# Altium schematic sheet [26] - BLE, WIFI.SchDoc (part 1 of 2)
size A2; DocumentNumber: 25; SheetNumber: 25; SheetTotal: 32
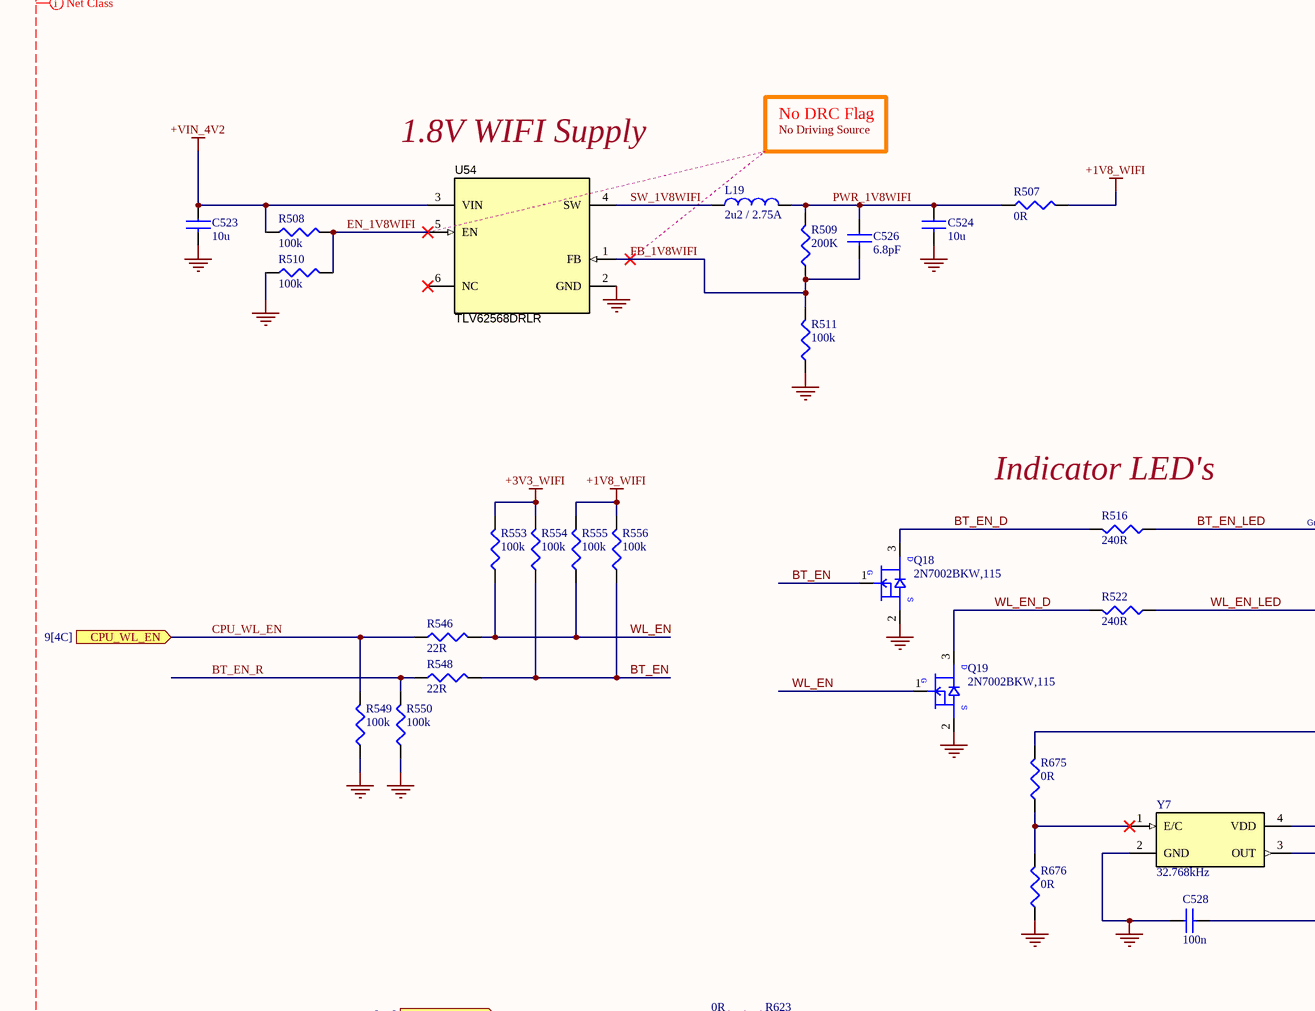
[diagram p0: [26] - BLE, WIFI.SchDoc, top left]
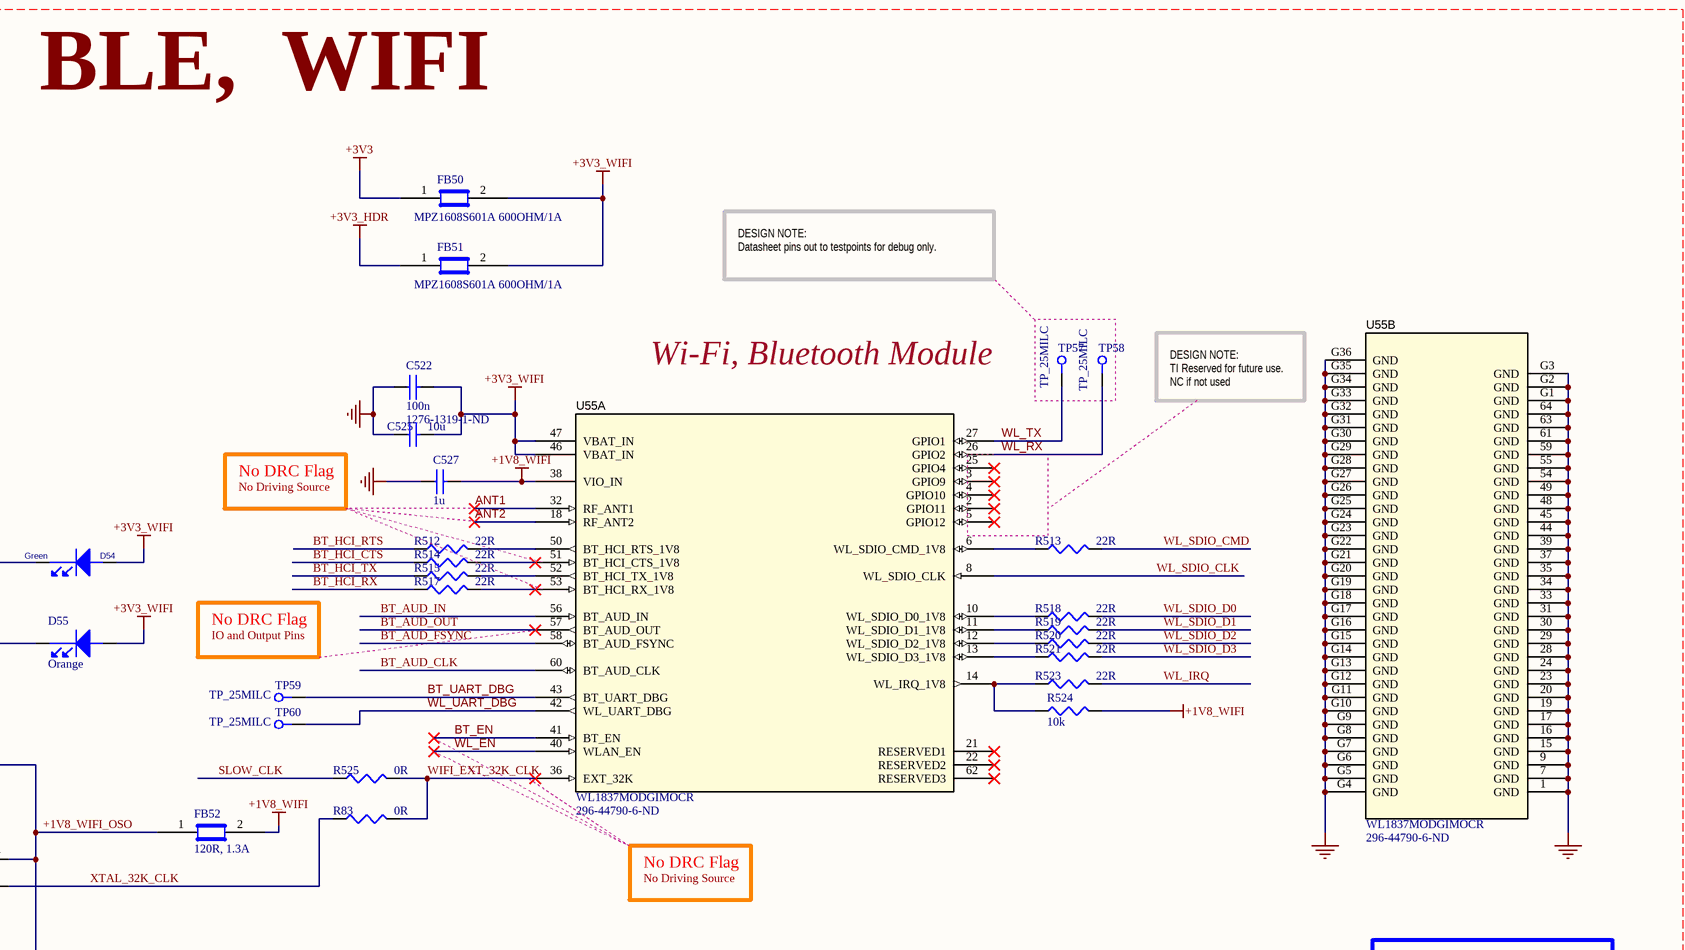
[diagram p1: [26] - BLE, WIFI.SchDoc, top right]
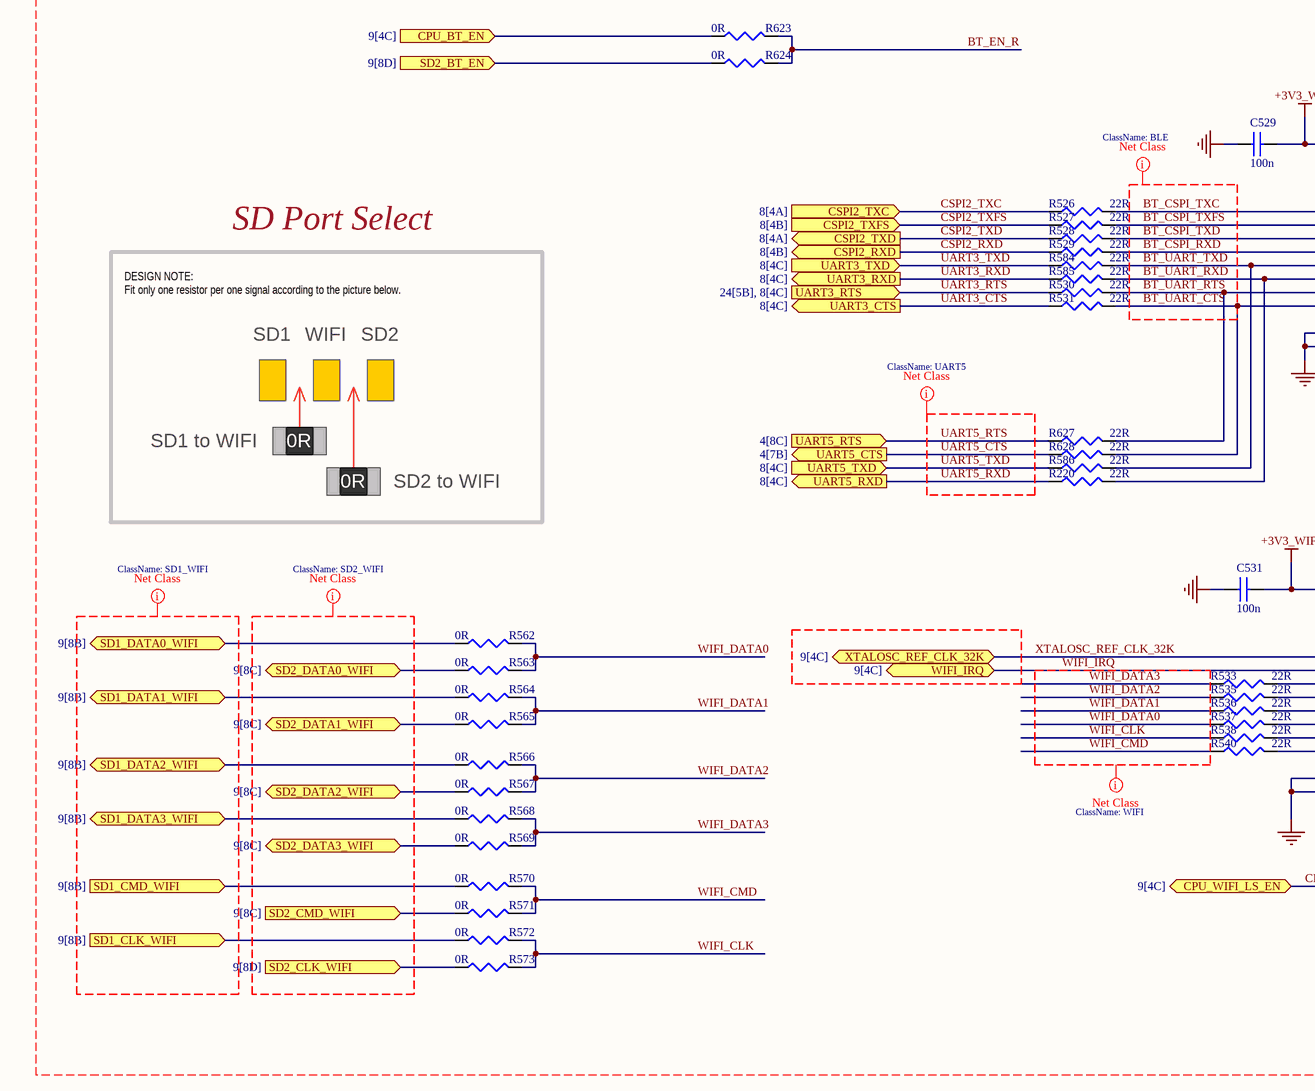
[diagram p2: [26] - BLE, WIFI.SchDoc, bottom left]
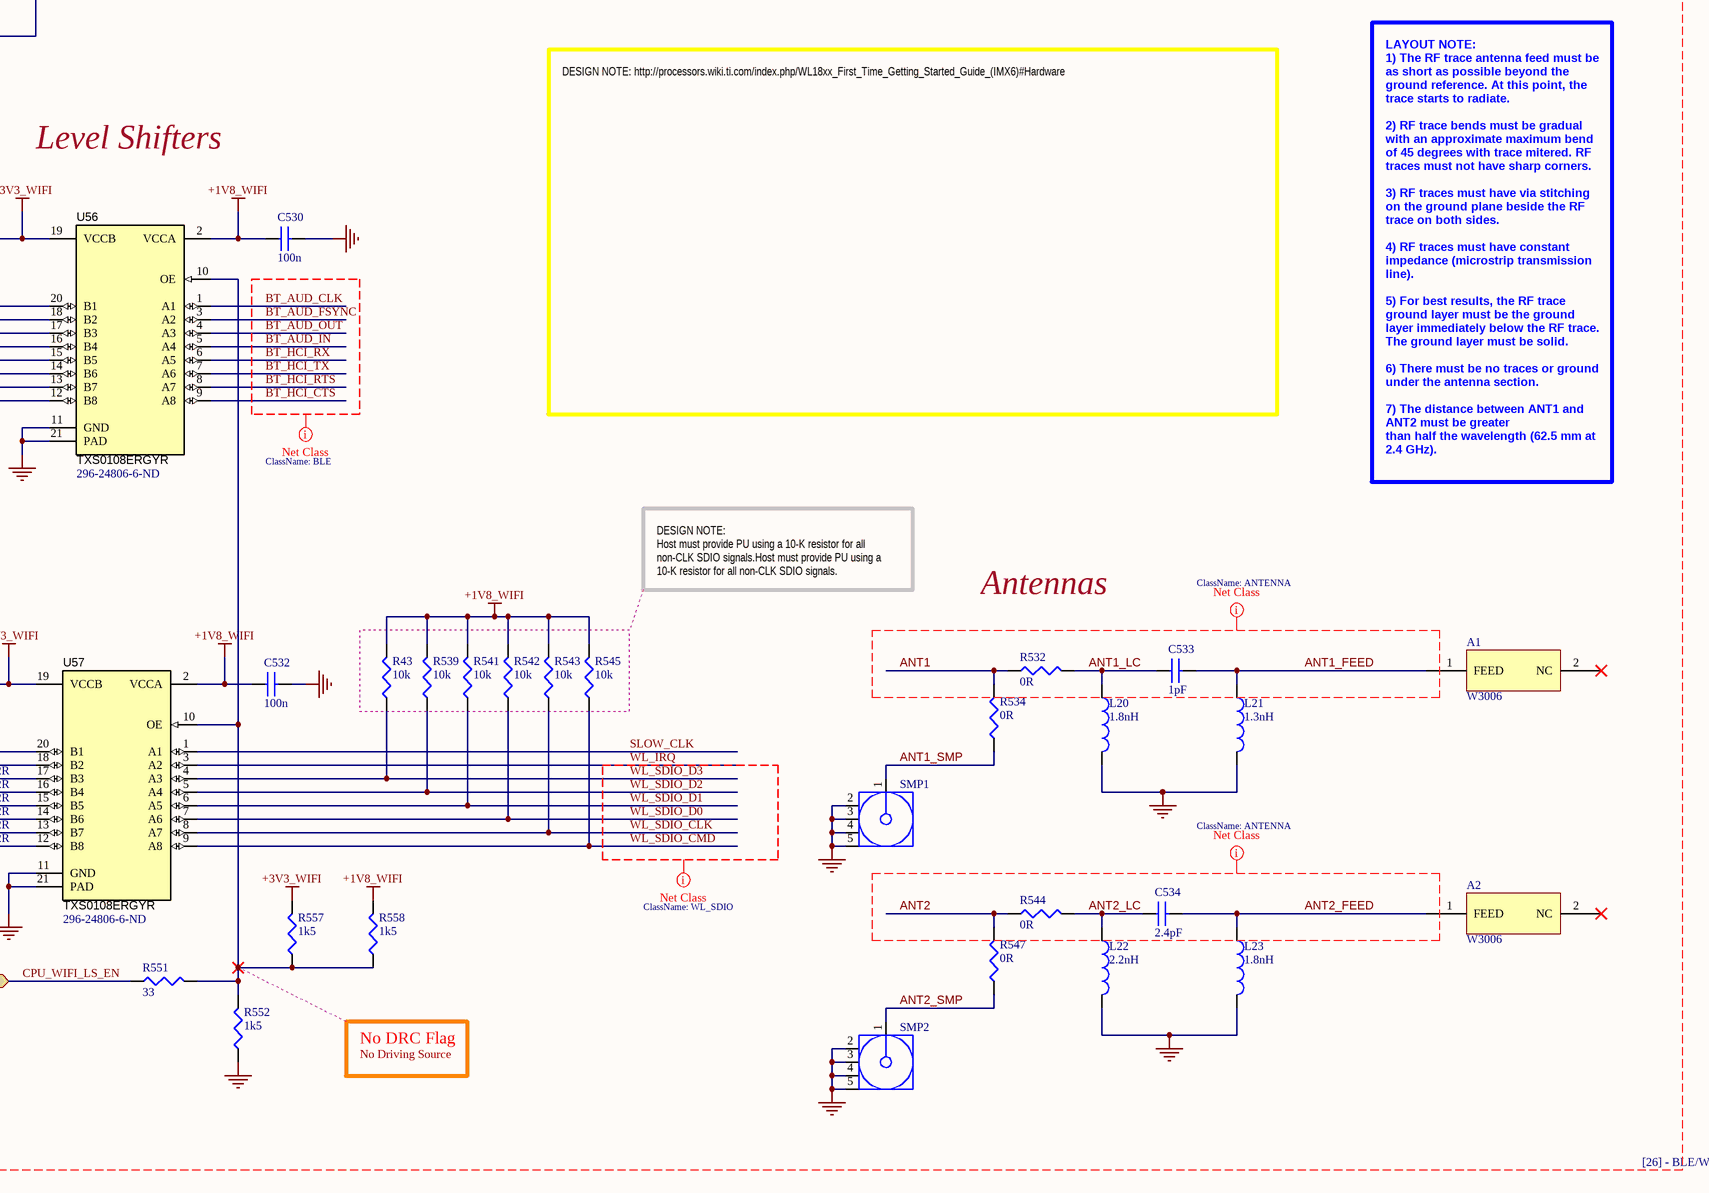
[diagram p3: [26] - BLE, WIFI.SchDoc, bottom right]

## Parts
A1  W3006  [W3006]
A2  W3006  [W3006]
C522  100n  Supplier Part Number 2: 1276-1319-1-ND  [C0201]
C523  10u  [C0603]
C524  10u  [C0603]
C525  10u  [C0603]
C526  6.8pF  [C0201]
C527  1u  [C0402]
C528  100n  [C0402]
C529  100n  [C0402]
C530  100n  [C0402]
C531  100n  [C0402]
C532  100n  [C0402]
C533  1pF  [C0402]
C534  2.4pF  [c0402]
D54  Green  [LED_0603]
D55  Orange  [LED_0603]
FB50  MPZ1608S601A 600OHM/1A  [C0603]
FB51  MPZ1608S601A 600OHM/1A  [C0603]
FB52  120R, 1.3A  [C0402]
L19  2u2 / 2.75A  [IHLP_160MILX175MIL]
L20  1.8nH  [LQP_0402]
L21  1.3nH  [LQP_0402]
L22  2.2nH  [LQP_0402]
L23  1.8nH  [LQP_0402]
Q18  2N7002BKW,115  [SC70_SOT323]
Q19  2N7002BKW,115  [SC70_SOT323]
R43  10k  [R0201]
R83  0R  [R0402]
R220  22R  [R0402]
R507  0R  [R0805_small]
R508  100k  [R0402]
R509  200K  [R0402]
R510  100k  [R0402]
R511  100k  [R0402]
R512  22R  [R0402]
R513  22R  [R0402]
R514  22R  [R0402]
R515  22R  [R0402]
R516  240R  [R0402]
R517  22R  [R0402]
R518  22R  [R0402]
R519  22R  [R0402]
R520  22R  [R0402]
R521  22R  [R0402]
R522  240R  [R0402]
R523  22R  [R0402]
R524  10k  [R0402]
R525  0R  [R0402]
R526  22R  [R0402]
R527  22R  [R0402]
R528  22R  [R0402]
R529  22R  [R0402]
R530  22R  [R0402]
R531  22R  [R0402]
R532  0R  [R0402]
R533  22R  [R0402]
R534  0R  [R0402]
R535  22R  [R0402]
R536  22R  [R0402]
R537  22R  [R0402]
R538  22R  [R0402]
R539  10k  [R0201]
R540  22R  [R0402]
R541  10k  [R0201]
R542  10k  [R0201]
R543  10k  [R0201]
R544  0R  [R0402]
R545  10k  [R0201]
R546  22R  [R0402]
R547  0R  [R0402]
R548  22R  [R0402]
R549  100k  [R0402]
R550  100k  [R0402]
R551  33  [R0201]
R552  1k5  [R0402]
R553  100k  [R0402]
R554  100k  [R0402]
R555  100k  [R0402]
R556  100k  [R0402]
R557  1k5  [R0402]
R558  1k5  [R0402]
R562  0R  [R0402]
R563  0R  [R0402]
R564  0R  [R0402]
R565  0R  [R0402]
R566  0R  [R0402]
R567  0R  [R0402]
R568  0R  [R0402]
R569  0R  [R0402]
R570  0R  [R0402]
R571  0R  [R0402]
R572  0R  [R0402]
R573  0R  [R0402]
R584  22R  [R0402]
R585  22R  [R0402]
R586  22R  [R0402]
R623  0R  [R0402]
R624  0R  [R0402]
R627  22R  [R0402]
R628  22R  [R0402]
R675  0R  [R0402]
R676  0R  [R0402]
SMP1  Coax Conn  [SMP-F]  (value not drawn)
SMP2  Coax Conn  [SMP-F]  (value not drawn)
TP57  TP_25MILC  [TP_25C]  (no BOM)
TP58  TP_25MILC  [TP_25C]  (no BOM)
TP59  TP_25MILC  [TP_25C]  (no BOM)
TP60  TP_25MILC  [TP_25C]  (no BOM)
U54  TLV62568DRLR  [DRL0006A]
U55  WL1837MODGIMOCR  Supplier Part Number 1: 296-44790-6-ND  [MOC0100A]  (parts A,B of 2)
U56  TXS0108ERGYR  Supplier Part Number 1: 296-24806-6-ND  [RGY0020A]
U57  TXS0108ERGYR  Supplier Part Number 1: 296-24806-6-ND  [RGY0020A]
Y7  32.768kHz  [ASDK2-32.768KHZ-LR-T3]

## Ports
CPU_BT_EN (in, see 9[4C]), CPU_WIFI_LS_EN (bidir, see 9[4C]), CPU_WL_EN (in, see 9[4C]), CSPI2_RXD (out, see 8[4B]), CSPI2_TXC (in, see 8[4A]), CSPI2_TXD (out, see 8[4A]), CSPI2_TXFS (in, see 8[4B]), SD1_CLK_WIFI (in, see 9[8B]), SD1_CMD_WIFI (in, see 9[8B]), SD1_DATA0_WIFI (bidir, see 9[8B]), SD1_DATA1_WIFI (bidir, see 9[8B]), SD1_DATA2_WIFI (bidir, see 9[8B]), SD1_DATA3_WIFI (bidir, see 9[8B]), SD2_BT_EN (in, see 9[8D]), SD2_CLK_WIFI (in, see 9[8D]), SD2_CMD_WIFI (in, see 9[8C]), SD2_DATA0_WIFI (bidir, see 9[8C]), SD2_DATA1_WIFI (bidir, see 9[8C]), SD2_DATA2_WIFI (bidir, see 9[8C]), SD2_DATA3_WIFI (bidir, see 9[8C]), UART3_CTS (out, see 8[4C]), UART3_RTS (in, see 24[5B], 8[4C]), UART3_RXD (out, see 8[4C]), UART3_TXD (in, see 8[4C]), UART5_CTS (out, see 4[7B]), UART5_RTS (in, see 4[8C]), UART5_RXD (out, see 8[4C]), UART5_TXD (in, see 8[4C]), WIFI_IRQ (bidir, see 9[4C]), XTALOSC_REF_CLK_32K (bidir, see 9[4C])

## Nets
+1V8_WIFI: C527.2 C530.1 C532.1 FB52.2 R43.2 R507.2 R524.2 R539.2 R541.2 R542.2 R543.2 R545.2 R555.2 R556.2 R558.2 U55.38(VIO_IN) U56.2(VCCA) U57.2(VCCA)
+3V3: FB50.1
+3V3_HDR: FB51.1
+3V3_WIFI: C522.2 C525.2 C529.2 C531.2 D54.2(ANODE) D55.2(ANODE) FB50.2 FB51.2 R553.2 R554.2 R557.2 U55.46(VBAT_IN) U55.47(VBAT_IN) U56.19(VCCB) U57.19(VCCB)
+VIN_4V2: C523.1 R508.1 U54.3(VIN)
GND: C522.1 C523.2 C524.2 C525.1 C527.1 C528.1 C529.1 C530.2 C531.1 C532.2 L20.2 L21.2 L22.2 L23.2 Q18.2(SOURCE) Q19.2(SOURCE) R510.1 R511.1 R549.1 R550.1 R552.1 R676.1 SMP1.2(GND) SMP1.3(GND) SMP1.4(GND) SMP1.5(GND) SMP2.2(GND) SMP2.3(GND) SMP2.4(GND) SMP2.5(GND) U54.2(GND) U55.1(GND) U55.7(GND) U55.9(GND) U55.15(GND) U55.16(GND) U55.17(GND) U55.19(GND) U55.20(GND) U55.23(GND) U55.24(GND) U55.28(GND) U55.29(GND) U55.30(GND) U55.31(GND) U55.33(GND) U55.34(GND) U55.35(GND) U55.37(GND) U55.39(GND) U55.44(GND) U55.45(GND) U55.48(GND) U55.49(GND) U55.54(GND) U55.55(GND) U55.59(GND) U55.61(GND) U55.63(GND) U55.64(GND) U55.G1(GND) U55.G2(GND) U55.G3(GND) U55.G4(GND) U55.G5(GND) U55.G6(GND) U55.G7(GND) U55.G8(GND) U55.G9(GND) U55.G10(GND) U55.G11(GND) U55.G12(GND) U55.G13(GND) U55.G14(GND) U55.G15(GND) U55.G16(GND) U55.G17(GND) U55.G18(GND) U55.G19(GND) U55.G20(GND) U55.G21(GND) U55.G22(GND) U55.G23(GND) U55.G24(GND) U55.G25(GND) U55.G26(GND) U55.G27(GND) U55.G28(GND) U55.G29(GND) U55.G30(GND) U55.G31(GND) U55.G32(GND) U55.G33(GND) U55.G34(GND) U55.G35(GND) U55.G36(GND) U56.11(GND) U56.21(PAD) U57.11(GND) U57.21(PAD) Y7.2(GND)
+1V8_WIFI_OSO: C528.2 FB52.1 R675.2 Y7.4(VDD)
ANT1: R532.1 R534.2 U55.32(RF_ANT1)
ANT1_FEED: A1.1(FEED) C533.2 L21.1
ANT1_LC: C533.1 L20.1 R532.2
ANT1_SMP: R534.1 SMP1.1(Signal)
ANT2: R544.1 R547.2 U55.18(RF_ANT2)
ANT2_FEED: A2.1(FEED) C534.2 L23.1
ANT2_LC: C534.1 L22.1 R544.2
ANT2_SMP: R547.1 SMP2.1(Signal)
BT_AUD_CLK: U55.60(BT_AUD_CLK) U56.1(A1)
BT_AUD_FSYNC: U55.58(BT_AUD_FSYNC) U56.3(A2)
BT_AUD_IN: U55.56(BT_AUD_IN) U56.5(A4)
BT_AUD_OUT: U55.57(BT_AUD_OUT) U56.4(A3)
BT_CSPI_RXD: R529.2 U56.16(B4)
BT_CSPI_TXC: R526.2 U56.20(B1)
BT_CSPI_TXD: R528.2 U56.17(B3)
BT_CSPI_TXFS: R527.2 U56.18(B2)
BT_EN: Q18.1(GATE) R548.2 R554.1 R556.1 U55.41(BT_EN)
BT_EN_D: Q18.3(DRAIN) R516.2
BT_EN_LED: D54.1(cathode) R516.1
BT_EN_R: R548.1 R550.2 R623.2 R624.2
BT_HCI_CTS: R514.1 U56.9(A8)
BT_HCI_RTS: R512.1 U56.8(A7)
BT_HCI_RX: R517.1 U56.6(A5)
BT_HCI_TX: R515.1 U56.7(A6)
BT_UART_CTS: R531.2 R628.2 U56.12(B8)
BT_UART_DBG: TP59.1 U55.43(BT_UART_DBG)
BT_UART_RTS: R530.2 R627.2 U56.13(B7)
BT_UART_RXD: R220.2 R585.2 U56.14(B6)
BT_UART_TXD: R584.2 R586.2 U56.15(B5)
CPU_BT_EN: R623.1 ; port CPU_BT_EN
CPU_WIFI_LS_EN: R551.1 ; port CPU_WIFI_LS_EN
CPU_WL_EN: R546.1 R549.2 ; port CPU_WL_EN
CSPI2_RXD: R529.1 ; port CSPI2_RXD
CSPI2_TXC: R526.1 ; port CSPI2_TXC
CSPI2_TXD: R528.1 ; port CSPI2_TXD
CSPI2_TXFS: R527.1 ; port CSPI2_TXFS
EN_1V8WIFI: R508.2 R510.2 U54.5(EN)
FB_1V8WIFI: C526.2 R509.1 R511.2 U54.1(FB)
PWR_1V8WIFI: C524.1 C526.1 L19.2 R507.1 R509.2
SD1_CLK_WIFI: R572.1 ; port SD1_CLK_WIFI
SD1_CMD_WIFI: R570.1 ; port SD1_CMD_WIFI
SD1_DATA0_WIFI: R562.1 ; port SD1_DATA0_WIFI
SD1_DATA1_WIFI: R564.1 ; port SD1_DATA1_WIFI
SD1_DATA2_WIFI: R566.1 ; port SD1_DATA2_WIFI
SD1_DATA3_WIFI: R568.1 ; port SD1_DATA3_WIFI
SD2_BT_EN: R624.1 ; port SD2_BT_EN
SD2_CLK_WIFI: R573.1 ; port SD2_CLK_WIFI
SD2_CMD_WIFI: R571.1 ; port SD2_CMD_WIFI
SD2_DATA0_WIFI: R563.1 ; port SD2_DATA0_WIFI
SD2_DATA1_WIFI: R565.1 ; port SD2_DATA1_WIFI
SD2_DATA2_WIFI: R567.1 ; port SD2_DATA2_WIFI
SD2_DATA3_WIFI: R569.1 ; port SD2_DATA3_WIFI
SLOW_CLK: R525.1 U57.1(A1)
SW_1V8WIFI: L19.1 U54.4(SW)
UART3_CTS: R531.1 ; port UART3_CTS
UART3_RTS: R530.1 ; port UART3_RTS
UART3_RXD: R585.1 ; port UART3_RXD
UART3_TXD: R584.1 ; port UART3_TXD
UART5_CTS: R628.1 ; port UART5_CTS
UART5_RTS: R627.1 ; port UART5_RTS
UART5_RXD: R220.1 ; port UART5_RXD
UART5_TXD: R586.1 ; port UART5_TXD
WIFI_CLK: R538.1 R572.2 R573.2
WIFI_CMD: R540.1 R570.2 R571.2
WIFI_DATA0: R537.1 R562.2 R563.2
WIFI_DATA1: R536.1 R564.2 R565.2
WIFI_DATA2: R535.1 R566.2 R567.2
WIFI_DATA3: R533.1 R568.2 R569.2
WIFI_EXT_32K_CLK: R83.2 R525.2 U55.36(EXT_32K)
WIFI_IRQ: U57.18(B2) ; port WIFI_IRQ
WL_EN: Q19.1(GATE) R546.2 R553.1 R555.1 U55.40(WLAN_EN)
WL_EN_D: Q19.3(DRAIN) R522.2
WL_EN_LED: D55.1(cathode) R522.1
WL_IRQ: R523.2 U57.3(A2)
WL_RX: TP58.1 U55.26(GPIO2)
WL_SDIO_CLK: R543.1 U55.8(WL_SDIO_CLK) U57.8(A7)
WL_SDIO_CMD: R513.2 R545.1 U57.9(A8)
WL_SDIO_D0: R518.2 R542.1 U57.7(A6)
WL_SDIO_D1: R519.2 R541.1 U57.6(A5)
WL_SDIO_D2: R520.2 R539.1 U57.5(A4)
WL_SDIO_D3: R43.1 R521.2 U57.4(A3)
WL_TX: TP57.1 U55.27(GPIO1)
WL_UART_DBG: TP60.1 U55.42(WL_UART_DBG)
XTAL_32K_CLK: R83.1 Y7.3(OUT)
XTALOSC_REF_CLK_32K: U57.20(B1) ; port XTALOSC_REF_CLK_32K
NetR512_2: R512.2 U55.50(BT_HCI_RTS_1V8)
NetR513_1: R513.1 U55.6(WL_SDIO_CMD_1V8)
NetR514_2: R514.2 U55.51(BT_HCI_CTS_1V8)
NetR515_2: R515.2 U55.52(BT_HCI_TX_1V8)
NetR517_2: R517.2 U55.53(BT_HCI_RX_1V8)
NetR518_1: R518.1 U55.10(WL_SDIO_D0_1V8)
NetR519_1: R519.1 U55.11(WL_SDIO_D1_1V8)
NetR520_1: R520.1 U55.12(WL_SDIO_D2_1V8)
NetR521_1: R521.1 U55.13(WL_SDIO_D3_1V8)
NetR523_1: R523.1 R524.1 U55.14(WL_IRQ_1V8)
NetR533_2: R533.2 U57.17(B3)
NetR535_2: R535.2 U57.16(B4)
NetR536_2: R536.2 U57.15(B5)
NetR537_2: R537.2 U57.14(B6)
NetR538_2: R538.2 U57.13(B7)
NetR540_2: R540.2 U57.12(B8)
NetR551_2: R551.2 R552.2 R557.1 R558.1 U56.10(OE) U57.10(OE)
NetR675_1: R675.1 R676.2 Y7.1(E/C)

Not connected (* = marked no-connect by the designer): A1 2(NC)*; A2 2(NC)*; U54 6(NC)*; U55 2(GPIO11)* 3(GPIO9)* 4(GPIO10)* 5(GPIO12)* 21(RESERVED1)* 22(RESERVED2)* 25(GPIO4)* 62(RESERVED3)*

## Layout directives
net class [26] - BLE/WIFI: +1V8_WIFI, +1V8_WIFI_OSO, +3V3, +3V3_HDR, +3V3_WIFI, +VIN_4V2, ANT1, ANT1_FEED, ANT1_LC, ANT1_SMP, ANT2, ANT2_FEED, ANT2_LC, ANT2_SMP, BT_AUD_CLK, BT_AUD_FSYNC, BT_AUD_IN, BT_AUD_OUT, BT_CSPI_RXD, BT_CSPI_TXC, BT_CSPI_TXD, BT_CSPI_TXFS, BT_EN, BT_EN_D, BT_EN_LED, BT_EN_R, BT_HCI_CTS, BT_HCI_RTS, BT_HCI_RX, BT_HCI_TX, BT_UART_CTS, BT_UART_DBG, BT_UART_RTS, BT_UART_RXD, BT_UART_TXD, CPU_WIFI_LS_EN, CPU_WL_EN, CSPI2_RXD, CSPI2_TXC, CSPI2_TXD, CSPI2_TXFS, EN_1V8WIFI, FB_1V8WIFI, GND, PWR_1V8WIFI, SLOW_CLK, SW_1V8WIFI, UART3_CTS, UART3_RTS, UART3_RXD, UART3_TXD, UART5_CTS, UART5_RTS, UART5_RXD, UART5_TXD, WIFI_CLK, WIFI_CMD, WIFI_DATA0, WIFI_DATA1, WIFI_DATA2, WIFI_DATA3, WIFI_EXT_32K_CLK, WIFI_IRQ, WL_EN, WL_EN_D, WL_EN_LED, WL_IRQ, WL_RX, WL_SDIO_CLK, WL_SDIO_CMD, WL_SDIO_D0, WL_SDIO_D1, WL_SDIO_D2, WL_SDIO_D3, WL_TX, WL_UART_DBG, XTAL_32K_CLK, XTALOSC_REF_CLK_32K
net class WIFI: +1V8_WIFI, +1V8_WIFI_OSO, +3V3, +3V3_HDR, +3V3_WIFI, +VIN_4V2, ANT1, ANT1_FEED, ANT1_LC, ANT1_SMP, ANT2, ANT2_FEED, ANT2_LC, ANT2_SMP, BT_AUD_CLK, BT_AUD_FSYNC, BT_AUD_IN, BT_AUD_OUT, BT_CSPI_RXD, BT_CSPI_TXC, BT_CSPI_TXD, BT_CSPI_TXFS, BT_EN, BT_EN_D, BT_EN_LED, BT_EN_R, BT_HCI_CTS, BT_HCI_RTS, BT_HCI_RX, BT_HCI_TX, BT_UART_CTS, BT_UART_DBG, BT_UART_RTS, BT_UART_RXD, BT_UART_TXD, CPU_WIFI_LS_EN, CPU_WL_EN, CSPI2_RXD, CSPI2_TXC, CSPI2_TXD, CSPI2_TXFS, EN_1V8WIFI, FB_1V8WIFI, GND, PWR_1V8WIFI, SLOW_CLK, SW_1V8WIFI, UART3_CTS, UART3_RTS, UART3_RXD, UART3_TXD, UART5_CTS, UART5_RTS, UART5_RXD, UART5_TXD, WIFI_CLK, WIFI_CMD, WIFI_DATA0, WIFI_DATA1, WIFI_DATA2, WIFI_DATA3, WIFI_EXT_32K_CLK, WIFI_IRQ, WL_EN, WL_EN_D, WL_EN_LED, WL_IRQ, WL_RX, WL_SDIO_CLK, WL_SDIO_CMD, WL_SDIO_D0, WL_SDIO_D1, WL_SDIO_D2, WL_SDIO_D3, WL_TX, WL_UART_DBG, XTAL_32K_CLK, XTALOSC_REF_CLK_32K
net class BLE: +1V8_WIFI, +1V8_WIFI_OSO, +3V3, +3V3_HDR, +3V3_WIFI, +VIN_4V2, ANT1, ANT1_FEED, ANT1_LC, ANT1_SMP, ANT2, ANT2_FEED, ANT2_LC, ANT2_SMP, BT_AUD_CLK, BT_AUD_FSYNC, BT_AUD_IN, BT_AUD_OUT, BT_CSPI_RXD, BT_CSPI_TXC, BT_CSPI_TXD, BT_CSPI_TXFS, BT_EN, BT_EN_D, BT_EN_LED, BT_EN_R, BT_HCI_CTS, BT_HCI_RTS, BT_HCI_RX, BT_HCI_TX, BT_UART_CTS, BT_UART_DBG, BT_UART_RTS, BT_UART_RXD, BT_UART_TXD, CPU_WIFI_LS_EN, CPU_WL_EN, CSPI2_RXD, CSPI2_TXC, CSPI2_TXD, CSPI2_TXFS, EN_1V8WIFI, FB_1V8WIFI, GND, PWR_1V8WIFI, SLOW_CLK, SW_1V8WIFI, UART3_CTS, UART3_RTS, UART3_RXD, UART3_TXD, UART5_CTS, UART5_RTS, UART5_RXD, UART5_TXD, WIFI_CLK, WIFI_CMD, WIFI_DATA0, WIFI_DATA1, WIFI_DATA2, WIFI_DATA3, WIFI_EXT_32K_CLK, WIFI_IRQ, WL_EN, WL_EN_D, WL_EN_LED, WL_IRQ, WL_RX, WL_SDIO_CLK, WL_SDIO_CMD, WL_SDIO_D0, WL_SDIO_D1, WL_SDIO_D2, WL_SDIO_D3, WL_TX, WL_UART_DBG, XTAL_32K_CLK, XTALOSC_REF_CLK_32K
net class WL_SDIO: +1V8_WIFI, +1V8_WIFI_OSO, +3V3, +3V3_HDR, +3V3_WIFI, +VIN_4V2, ANT1, ANT1_FEED, ANT1_LC, ANT1_SMP, ANT2, ANT2_FEED, ANT2_LC, ANT2_SMP, BT_AUD_CLK, BT_AUD_FSYNC, BT_AUD_IN, BT_AUD_OUT, BT_CSPI_RXD, BT_CSPI_TXC, BT_CSPI_TXD, BT_CSPI_TXFS, BT_EN, BT_EN_D, BT_EN_LED, BT_EN_R, BT_HCI_CTS, BT_HCI_RTS, BT_HCI_RX, BT_HCI_TX, BT_UART_CTS, BT_UART_DBG, BT_UART_RTS, BT_UART_RXD, BT_UART_TXD, CPU_WIFI_LS_EN, CPU_WL_EN, CSPI2_RXD, CSPI2_TXC, CSPI2_TXD, CSPI2_TXFS, EN_1V8WIFI, FB_1V8WIFI, GND, PWR_1V8WIFI, SLOW_CLK, SW_1V8WIFI, UART3_CTS, UART3_RTS, UART3_RXD, UART3_TXD, UART5_CTS, UART5_RTS, UART5_RXD, UART5_TXD, WIFI_CLK, WIFI_CMD, WIFI_DATA0, WIFI_DATA1, WIFI_DATA2, WIFI_DATA3, WIFI_EXT_32K_CLK, WIFI_IRQ, WL_EN, WL_EN_D, WL_EN_LED, WL_IRQ, WL_RX, WL_SDIO_CLK, WL_SDIO_CMD, WL_SDIO_D0, WL_SDIO_D1, WL_SDIO_D2, WL_SDIO_D3, WL_TX, WL_UART_DBG, XTAL_32K_CLK, XTALOSC_REF_CLK_32K
net class SD1_WIFI: +1V8_WIFI, +1V8_WIFI_OSO, +3V3, +3V3_HDR, +3V3_WIFI, +VIN_4V2, ANT1, ANT1_FEED, ANT1_LC, ANT1_SMP, ANT2, ANT2_FEED, ANT2_LC, ANT2_SMP, BT_AUD_CLK, BT_AUD_FSYNC, BT_AUD_IN, BT_AUD_OUT, BT_CSPI_RXD, BT_CSPI_TXC, BT_CSPI_TXD, BT_CSPI_TXFS, BT_EN, BT_EN_D, BT_EN_LED, BT_EN_R, BT_HCI_CTS, BT_HCI_RTS, BT_HCI_RX, BT_HCI_TX, BT_UART_CTS, BT_UART_DBG, BT_UART_RTS, BT_UART_RXD, BT_UART_TXD, CPU_WIFI_LS_EN, CPU_WL_EN, CSPI2_RXD, CSPI2_TXC, CSPI2_TXD, CSPI2_TXFS, EN_1V8WIFI, FB_1V8WIFI, GND, PWR_1V8WIFI, SLOW_CLK, SW_1V8WIFI, UART3_CTS, UART3_RTS, UART3_RXD, UART3_TXD, UART5_CTS, UART5_RTS, UART5_RXD, UART5_TXD, WIFI_CLK, WIFI_CMD, WIFI_DATA0, WIFI_DATA1, WIFI_DATA2, WIFI_DATA3, WIFI_EXT_32K_CLK, WIFI_IRQ, WL_EN, WL_EN_D, WL_EN_LED, WL_IRQ, WL_RX, WL_SDIO_CLK, WL_SDIO_CMD, WL_SDIO_D0, WL_SDIO_D1, WL_SDIO_D2, WL_SDIO_D3, WL_TX, WL_UART_DBG, XTAL_32K_CLK, XTALOSC_REF_CLK_32K
net class SD2_WIFI: +1V8_WIFI, +1V8_WIFI_OSO, +3V3, +3V3_HDR, +3V3_WIFI, +VIN_4V2, ANT1, ANT1_FEED, ANT1_LC, ANT1_SMP, ANT2, ANT2_FEED, ANT2_LC, ANT2_SMP, BT_AUD_CLK, BT_AUD_FSYNC, BT_AUD_IN, BT_AUD_OUT, BT_CSPI_RXD, BT_CSPI_TXC, BT_CSPI_TXD, BT_CSPI_TXFS, BT_EN, BT_EN_D, BT_EN_LED, BT_EN_R, BT_HCI_CTS, BT_HCI_RTS, BT_HCI_RX, BT_HCI_TX, BT_UART_CTS, BT_UART_DBG, BT_UART_RTS, BT_UART_RXD, BT_UART_TXD, CPU_WIFI_LS_EN, CPU_WL_EN, CSPI2_RXD, CSPI2_TXC, CSPI2_TXD, CSPI2_TXFS, EN_1V8WIFI, FB_1V8WIFI, GND, PWR_1V8WIFI, SLOW_CLK, SW_1V8WIFI, UART3_CTS, UART3_RTS, UART3_RXD, UART3_TXD, UART5_CTS, UART5_RTS, UART5_RXD, UART5_TXD, WIFI_CLK, WIFI_CMD, WIFI_DATA0, WIFI_DATA1, WIFI_DATA2, WIFI_DATA3, WIFI_EXT_32K_CLK, WIFI_IRQ, WL_EN, WL_EN_D, WL_EN_LED, WL_IRQ, WL_RX, WL_SDIO_CLK, WL_SDIO_CMD, WL_SDIO_D0, WL_SDIO_D1, WL_SDIO_D2, WL_SDIO_D3, WL_TX, WL_UART_DBG, XTAL_32K_CLK, XTALOSC_REF_CLK_32K
net class UART5: +1V8_WIFI, +1V8_WIFI_OSO, +3V3, +3V3_HDR, +3V3_WIFI, +VIN_4V2, ANT1, ANT1_FEED, ANT1_LC, ANT1_SMP, ANT2, ANT2_FEED, ANT2_LC, ANT2_SMP, BT_AUD_CLK, BT_AUD_FSYNC, BT_AUD_IN, BT_AUD_OUT, BT_CSPI_RXD, BT_CSPI_TXC, BT_CSPI_TXD, BT_CSPI_TXFS, BT_EN, BT_EN_D, BT_EN_LED, BT_EN_R, BT_HCI_CTS, BT_HCI_RTS, BT_HCI_RX, BT_HCI_TX, BT_UART_CTS, BT_UART_DBG, BT_UART_RTS, BT_UART_RXD, BT_UART_TXD, CPU_WIFI_LS_EN, CPU_WL_EN, CSPI2_RXD, CSPI2_TXC, CSPI2_TXD, CSPI2_TXFS, EN_1V8WIFI, FB_1V8WIFI, GND, PWR_1V8WIFI, SLOW_CLK, SW_1V8WIFI, UART3_CTS, UART3_RTS, UART3_RXD, UART3_TXD, UART5_CTS, UART5_RTS, UART5_RXD, UART5_TXD, WIFI_CLK, WIFI_CMD, WIFI_DATA0, WIFI_DATA1, WIFI_DATA2, WIFI_DATA3, WIFI_EXT_32K_CLK, WIFI_IRQ, WL_EN, WL_EN_D, WL_EN_LED, WL_IRQ, WL_RX, WL_SDIO_CLK, WL_SDIO_CMD, WL_SDIO_D0, WL_SDIO_D1, WL_SDIO_D2, WL_SDIO_D3, WL_TX, WL_UART_DBG, XTAL_32K_CLK, XTALOSC_REF_CLK_32K
net class ANTENNA: +1V8_WIFI, +1V8_WIFI_OSO, +3V3, +3V3_HDR, +3V3_WIFI, +VIN_4V2, ANT1, ANT1_FEED, ANT1_LC, ANT1_SMP, ANT2, ANT2_FEED, ANT2_LC, ANT2_SMP, BT_AUD_CLK, BT_AUD_FSYNC, BT_AUD_IN, BT_AUD_OUT, BT_CSPI_RXD, BT_CSPI_TXC, BT_CSPI_TXD, BT_CSPI_TXFS, BT_EN, BT_EN_D, BT_EN_LED, BT_EN_R, BT_HCI_CTS, BT_HCI_RTS, BT_HCI_RX, BT_HCI_TX, BT_UART_CTS, BT_UART_DBG, BT_UART_RTS, BT_UART_RXD, BT_UART_TXD, CPU_WIFI_LS_EN, CPU_WL_EN, CSPI2_RXD, CSPI2_TXC, CSPI2_TXD, CSPI2_TXFS, EN_1V8WIFI, FB_1V8WIFI, GND, PWR_1V8WIFI, SLOW_CLK, SW_1V8WIFI, UART3_CTS, UART3_RTS, UART3_RXD, UART3_TXD, UART5_CTS, UART5_RTS, UART5_RXD, UART5_TXD, WIFI_CLK, WIFI_CMD, WIFI_DATA0, WIFI_DATA1, WIFI_DATA2, WIFI_DATA3, WIFI_EXT_32K_CLK, WIFI_IRQ, WL_EN, WL_EN_D, WL_EN_LED, WL_IRQ, WL_RX, WL_SDIO_CLK, WL_SDIO_CMD, WL_SDIO_D0, WL_SDIO_D1, WL_SDIO_D2, WL_SDIO_D3, WL_TX, WL_UART_DBG, XTAL_32K_CLK, XTALOSC_REF_CLK_32K

## Notes on the sheet
- No DRC Flag
- BLE,  WIFI
- 1.8V WIFI Supply
- No Driving Source
- DESIGN NOTE:
  Datasheet pins out to testpoints for debug only.
- (near TP57) Wi-Fi, Bluetooth Module
- DESIGN NOTE:
  TI Reserved for future use.
  NC if not used
- (near R516) Indicator LED's
- IO and Output Pins
- Level Shifters
- DESIGN NOTE: http://processors.wiki.ti.com/index.php/WL18xx_First_Time_Getting_Started_Guide_(IMX6)#Hardware
- SD Port Select
- DESIGN NOTE:
  Fit only one resistor per one signal according to the picture below.
- SD1
- WIFI
- SD2
- LAYOUT NOTE:
  1) The RF trace antenna feed must be as short as possible beyond the ground reference. At this point, the trace starts to radiate.
  2) RF trace bends must be gradual with an approximate maximum bend of 45 degrees with trace mitered. RF
  traces must not have sharp corners.
  3) RF traces must have via stitching on the ground plane beside the RF trace on both sides.
  4) RF traces must have constant impedance (microstrip transmission line).
  5) For best results, the RF trace ground layer must be the ground layer immediately below the RF trace. The ground layer must be solid.
  6) There must be no traces or ground under the antenna section.
  7) The distance between ANT1 and ANT2 must be greater
  than half the wavelength (62.5 mm at 2.4 GHz).
- SD1 to WIFI
- 0R
- SD2 to WIFI
- DESIGN NOTE:
  Host must provide PU using a 10-K resistor for all non-CLK SDIO signals.Host must provide PU using a 10-K resistor for all non-CLK SDIO signals.
- Antennas
- (in symbol 2N7002BKW,115) D; G; S